# Altium project SolarPanel7Cells.PrjPcb
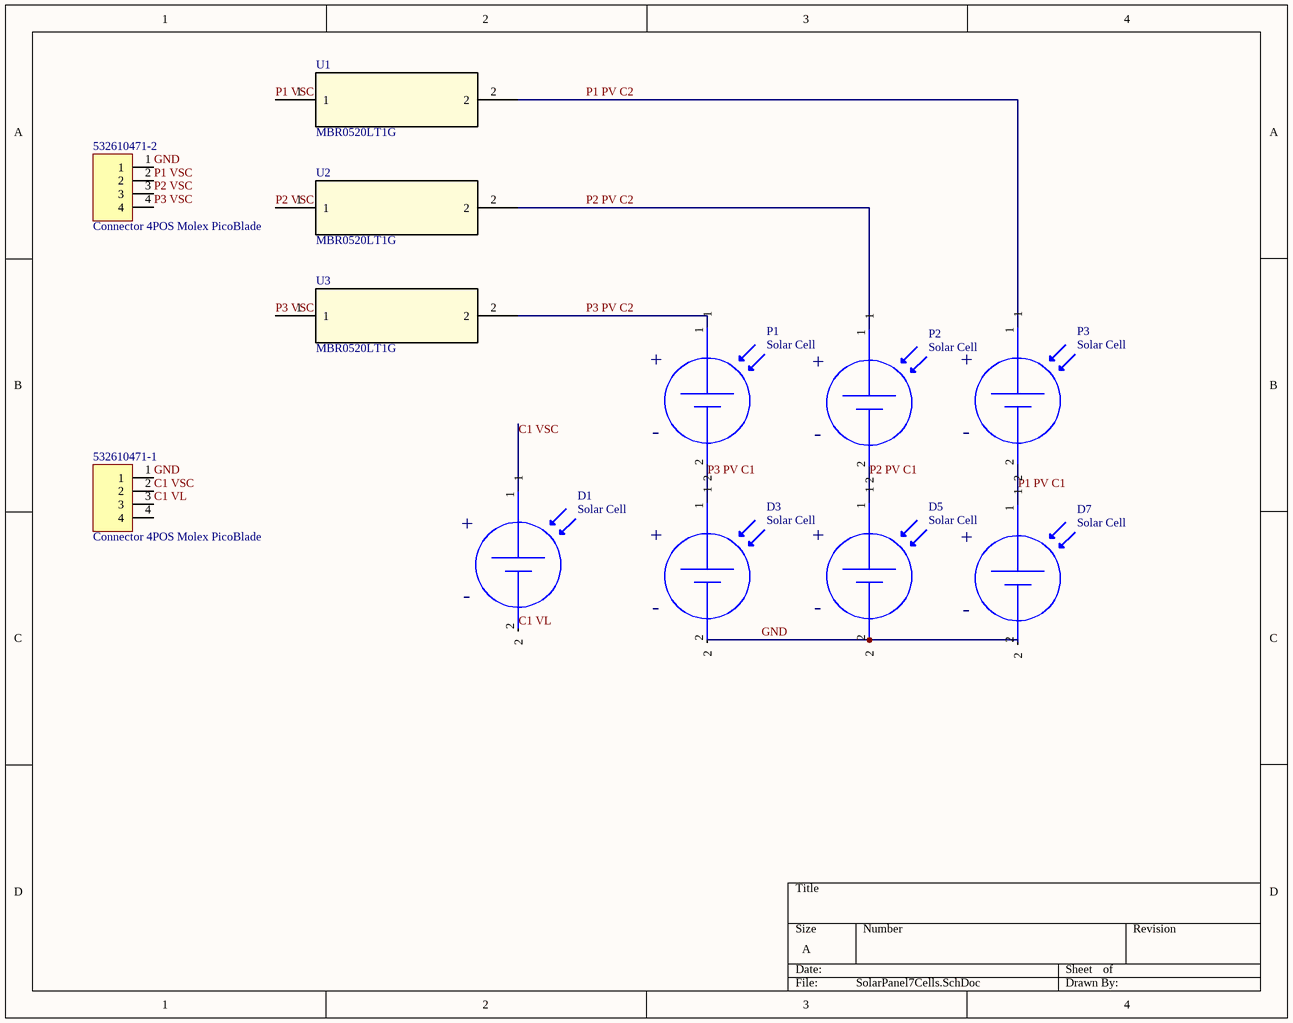
[diagram p0: SolarPanel7Cells.SchDoc]
1 sheet, 12 parts. Net scope: global (net labels, ports and power ports of the same name join across sheets).
Board file: SolarPanel7Cells2.PcbDoc

## Sheet SolarPanel7Cells.SchDoc
size A

### Parts
532610471-1  Connector 4POS Molex PicoBlade  [532610471]
532610471-2  Connector 4POS Molex PicoBlade  [532610471]
D1  Solar Cell  [SolAeroBJT]
D3  Solar Cell  [SolAeroBJT]
D5  Solar Cell  [SolAeroBJT]
D7  Solar Cell  [SolAeroBJT]
P1  Solar Cell  [SolAeroBJT]
P2  Solar Cell  [SolAeroBJT]
P3  Solar Cell  [SolAeroBJT]
U1  MBR0520LT1G  [SOD-123]
U2  MBR0520LT1G  [SOD-123]
U3  MBR0520LT1G  [SOD-123]

### Nets
C1 VL: 532610471-1.3 D1.2
C1 VSC: 532610471-1.2 D1.1
GND: 532610471-1.1 532610471-2.1 D3.2 D5.2 D7.2
P1 PV C1: D7.1 P3.2
P1 PV C2: P3.1 U1.2
P1 VSC: 532610471-2.2 U1.1
P2 PV C1: D5.1 P2.2
P2 PV C2: P2.1 U2.2
P2 VSC: 532610471-2.3 U2.1
P3 PV C1: D3.1 P1.2
P3 PV C2: P1.1 U3.2
P3 VSC: 532610471-2.4 U3.1

Not connected (* = marked no-connect by the designer): 532610471-1 4

### Notes on the sheet
- (in symbol SolAeroBJT1) +; -

### Library data of the parts
532610471-1 532610471-2 = 532610471
D1 D3 D5 D7 P1-P3 = SolAeroBJT1: SolAero BJT Space Solar Cell
U1-U3 = MBR0520LT1G: Imported; Vendor: ON Semiconductor; C: Copyright (C) 2015 Accelerated Designs. All rights reserved; Manufacturer_Part_Number: MBR0520LT1G; Copyright: Copyright (C) 2015 Accelerated Designs. All rights reserved; Value: Value; Type: Type; RefDes: RefDes